# EasyEDA schematic 4.24.json
TITLE: Sheet_1; REV: 1.0; Date: 2020-11-17; Sheet: 1/1; Drawn By: Gökbey Keskin; Company: Your Company
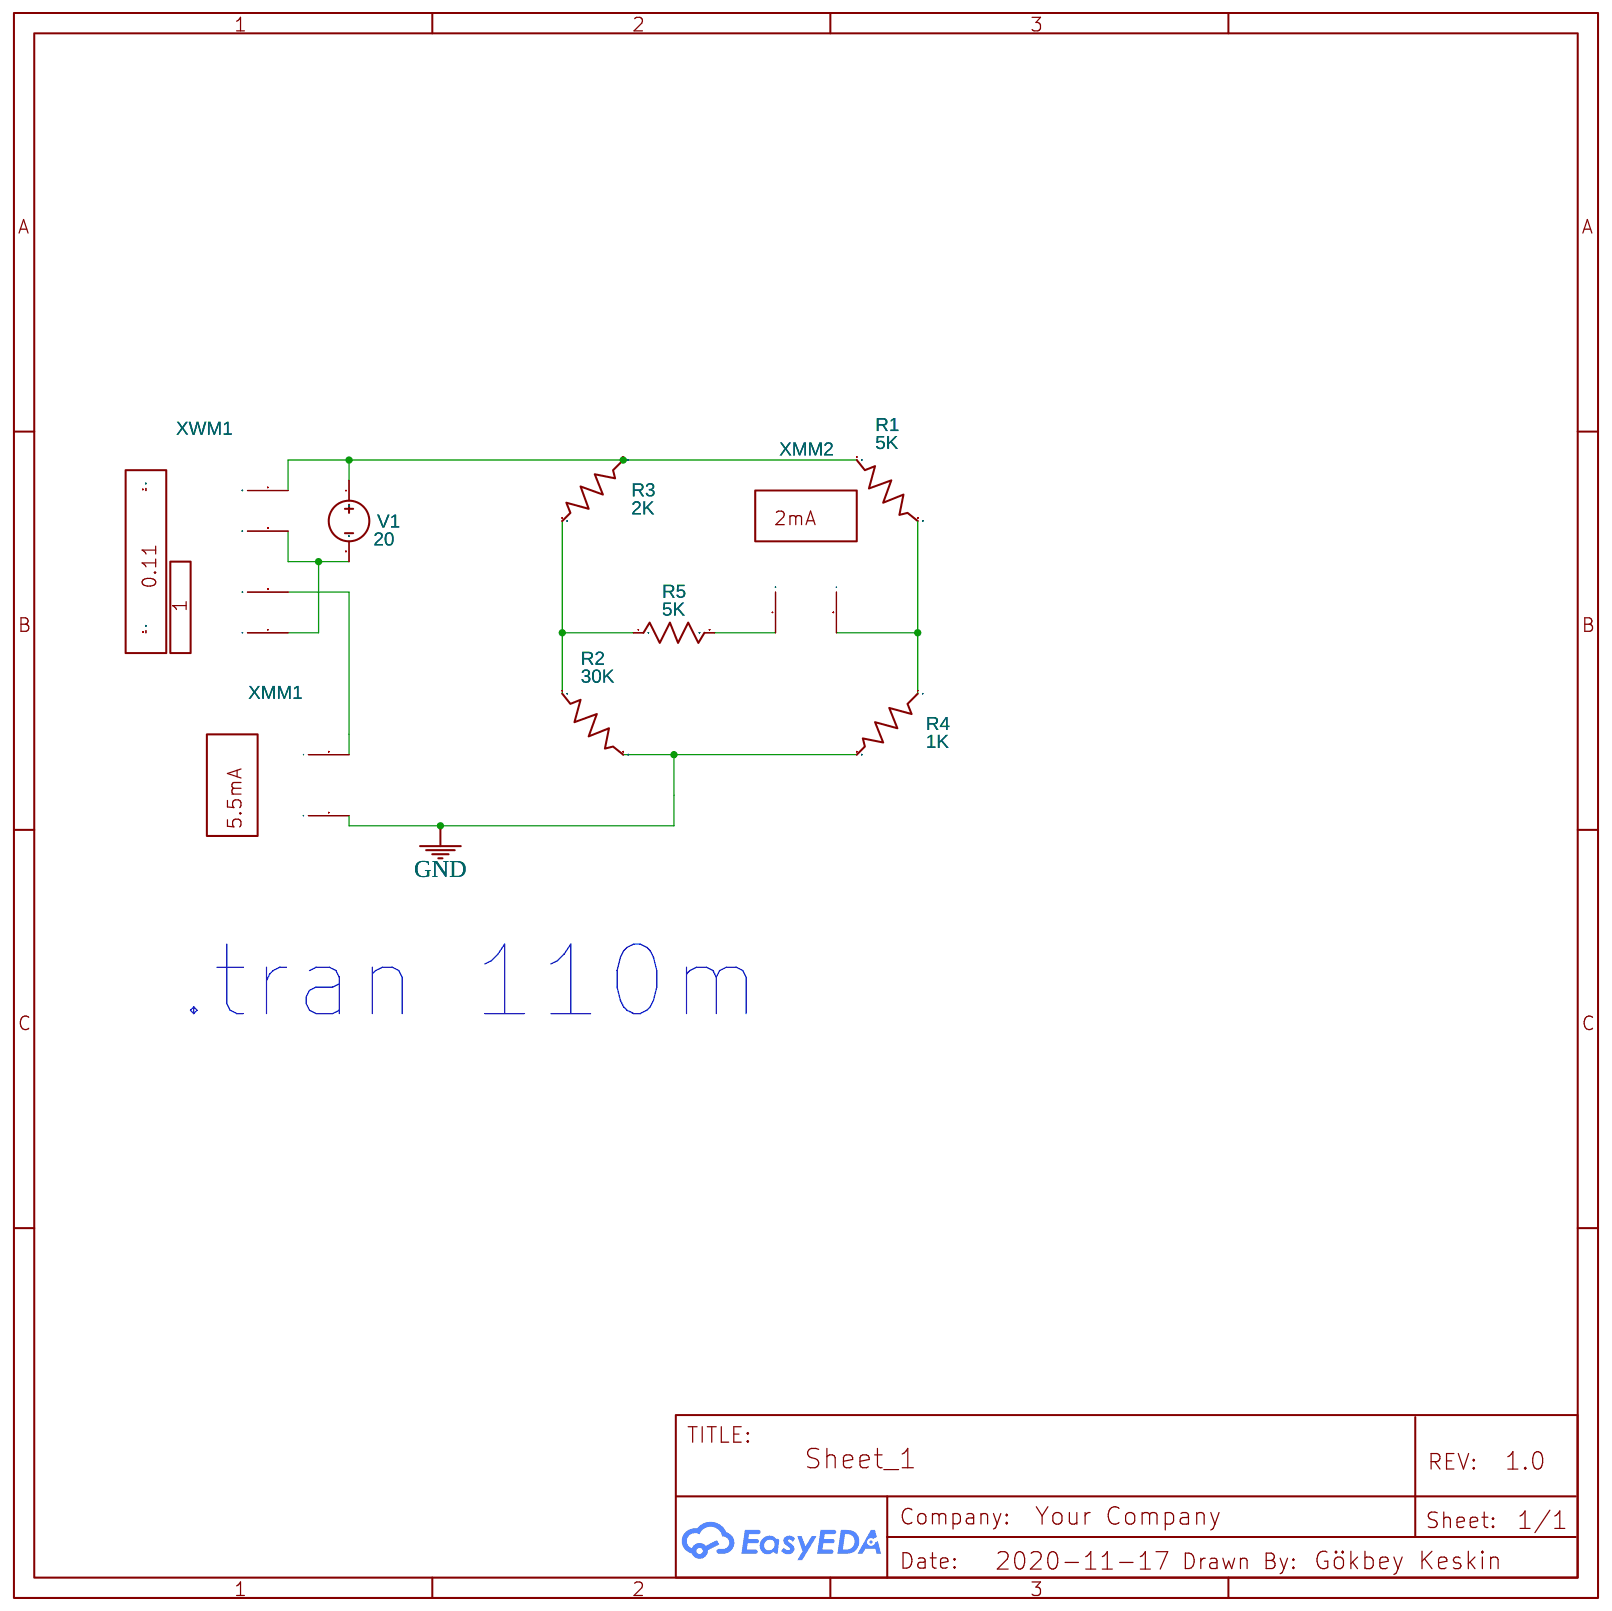
[diagram p0: schematic sheet]

## Parts
R1  5K  [AXIAL-0.3]
R2  30K  [AXIAL-0.3]
R3  2K  [AXIAL-0.3]
R4  1K  [AXIAL-0.3]
R5  5K  [AXIAL-0.3]
V1  20  [HDR1X2]
XMM1  Multimeter
XMM2  Multimeter
XWM1  Wattmeter

## Library data of the parts
R1-R3 = Resistor_45Degree_US: Supplier: YUJING; Contributor: EasyEDA; Resistance: 1K
R4 = Resistor_45Degree_US: Supplier: YUJING; Contributor: EasyEDA
R5 = Resistor_US: Resistance: 1k; Contributor: EasyEDA; Supplier: YUJING
V1 = VDC: Contributor: EasyEDA; sim: true
XMM1 XMM2 = MULTIMETER: Supplier: LCSC; Multimeter Type: Amper; Power Type: AC; Voltmeter resistance: 10μ; Ammeter resistance: 1G; NameDisplay: 0; Contributor: EasyEDA; sim: true
XWM1 = WATTMETER: Contributor: EasyEDA; NameDisplay: 0; sim: true

## Nets
GND: R2.2 R4.2 XMM1.1(+)
Net-(R1-1): R1.1 R3.2 V1.1 XWM1.1(V+)
Net-(R1-2): R1.2 R4.1 XMM2.2(I)
Net-(R2-1): R2.1 R3.1 R5.1
Net-(R5-2): R5.2 XMM2.1(+)
Net-(V1-2): V1.2 XWM1.2(V-) XWM1.4(I-)
Net-(XMM1-2): XMM1.2(I) XWM1.3(I+)

Not connected (* = marked no-connect by the designer): XWM1 P PF

## Notes on the sheet
- .tran 110m
